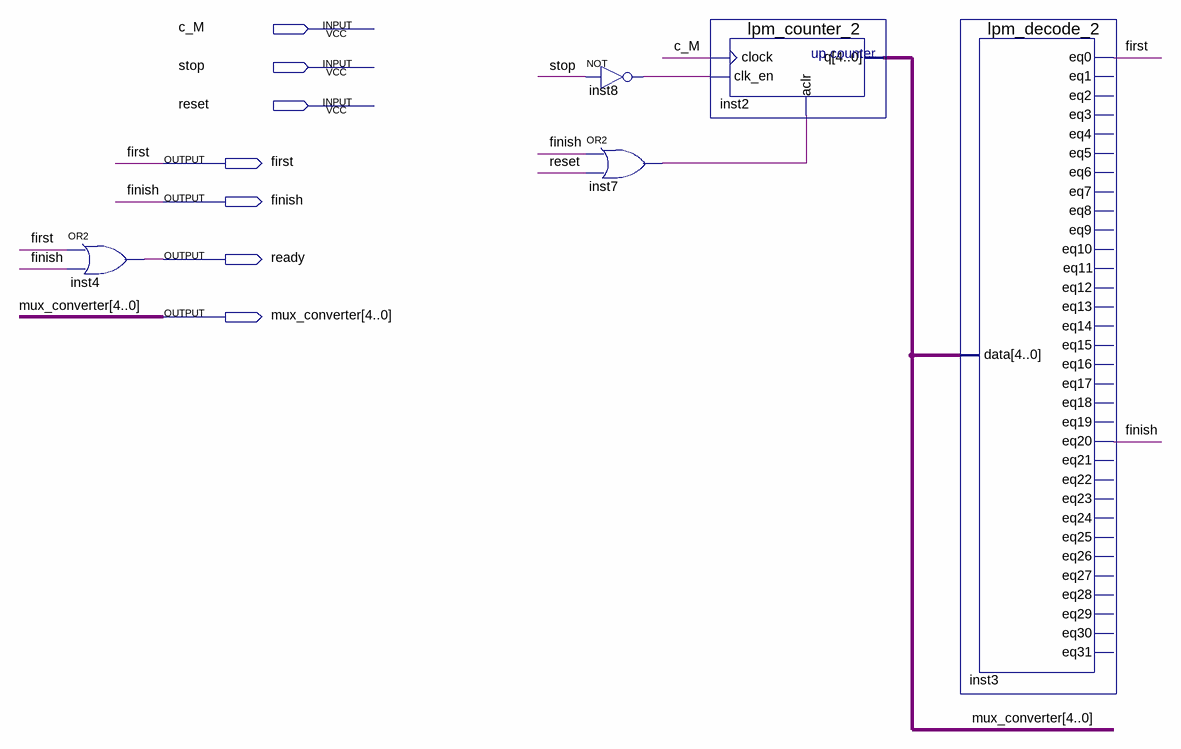
[diagram p0: schematic sheet]
// Quartus schematic create_ready_signal_mux.bdf as structural Verilog: 5 symbols, 7 pins
module create_ready_signal_mux (
  input  c_M,
  input  stop,
  input  reset,
  output first,
  output finish,
  output ready,
  output [4:0] mux_converter
);

  wire inst7_out, inst8_out;

  or inst4 (ready, first, finish);
  not inst8 (inst8_out, stop);
  or inst7 (inst7_out, finish, reset);
  lpm_counter_2 inst2 (.clock(c_M), .clk_en(inst8_out), .aclr(inst7_out), .q(mux_converter));
  lpm_decode_2 inst3 (
    .data(mux_converter), .eq0(first), .eq20(finish));  // open: eq1, eq2, eq3, eq4, eq5, eq6, eq7, eq8, eq9, eq10, eq11, eq12, eq13, eq14, eq15, eq16, eq17, eq18, eq19, eq21, eq22, eq23, eq24, eq25, eq26, eq27, eq28, eq29, eq30, eq31
endmodule
